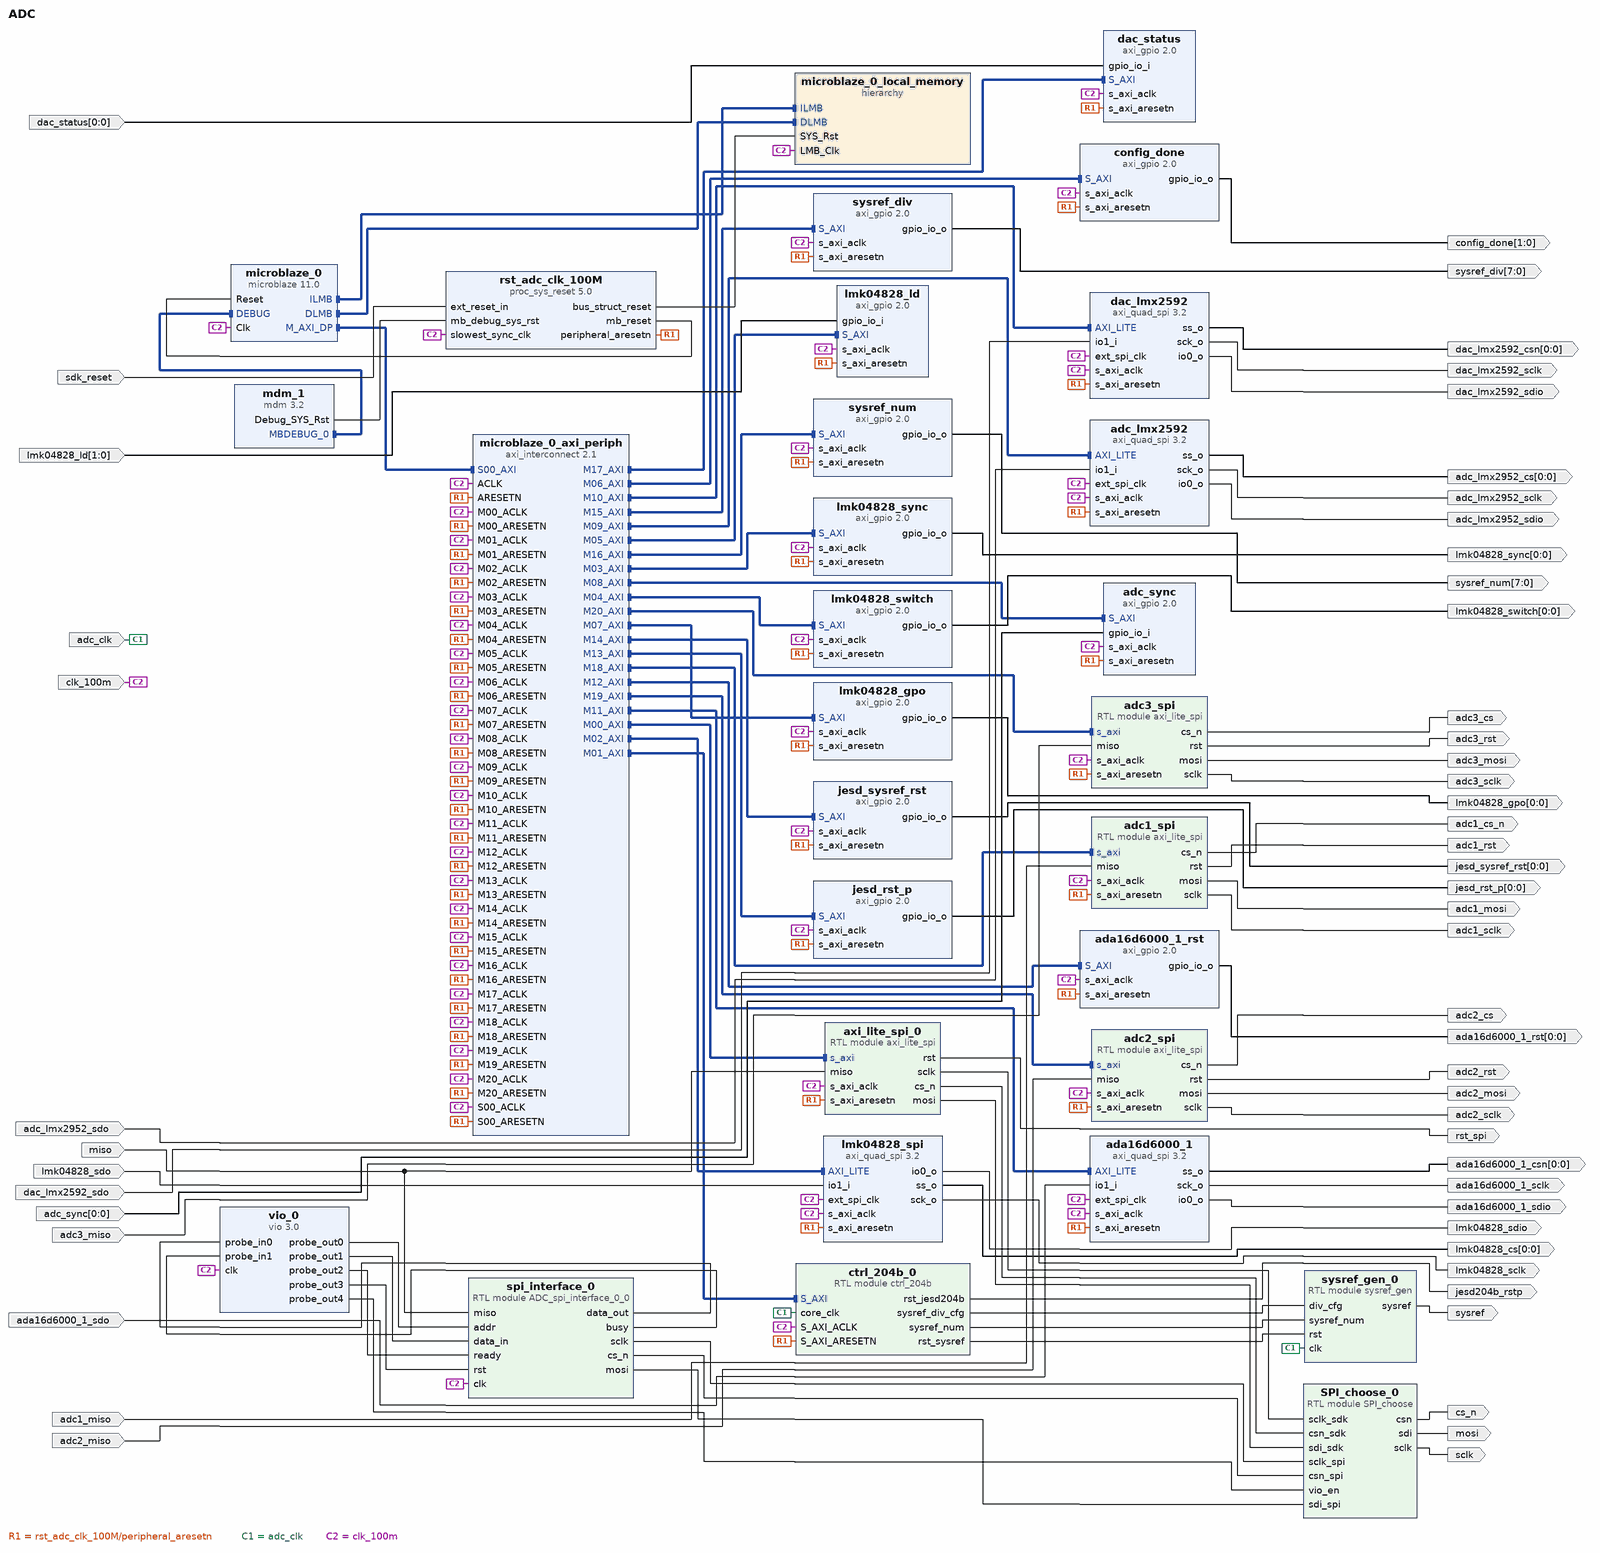
[diagram p0: block diagram of the top level]
# Vivado block design ADC, xc7vx690tffg1927-2, Vivado 2018.3
create_bd_design ADC

create_bd_port -dir O sysref
create_bd_port -dir O jesd204b_rstp
create_bd_port -dir I miso
create_bd_port -dir O mosi
create_bd_port -dir O sclk
create_bd_port -dir O cs_n
create_bd_port -dir O -type rst rst_spi
create_bd_port -dir O lmk04828_sdio
create_bd_port -dir I lmk04828_sdo
create_bd_port -dir O lmk04828_sclk
create_bd_port -dir O -from 0 -to 0 lmk04828_cs
create_bd_port -dir O -from 0 -to 0 lmk04828_sync
create_bd_port -dir O -from 0 -to 0 lmk04828_switch
create_bd_port -dir O -from 1 -to 0 config_done
create_bd_port -dir O -from 0 -to 0 lmk04828_gpo
create_bd_port -dir O adc_lmx2952_sdio
create_bd_port -dir I adc_lmx2952_sdo
create_bd_port -dir O adc_lmx2952_sclk
create_bd_port -dir O -from 0 -to 0 adc_lmx2952_cs
create_bd_port -dir I -type rst sdk_reset
set_property -dict {CONFIG.POLARITY ACTIVE_HIGH} [get_bd_ports sdk_reset]
create_bd_port -dir I -type clk clk_100m
create_bd_port -dir I -type clk adc_clk
create_bd_port -dir I -from 1 -to 0 lmk04828_ld
create_bd_port -dir I -from 0 -to 0 adc_sync
create_bd_port -dir O dac_lmx2592_sdio
create_bd_port -dir I dac_lmx2592_sdo
create_bd_port -dir O dac_lmx2592_sclk
create_bd_port -dir O -from 0 -to 0 dac_lmx2592_csn
create_bd_port -dir O ada16d6000_1_sdio
create_bd_port -dir I ada16d6000_1_sdo
create_bd_port -dir O ada16d6000_1_sclk
create_bd_port -dir O -from 0 -to 0 ada16d6000_1_csn
create_bd_port -dir O -from 0 -to 0 ada16d6000_1_rst
create_bd_port -dir O -from 0 -to 0 jesd_rst_p
create_bd_port -dir O -from 0 -to 0 jesd_sysref_rst
create_bd_port -dir O -from 7 -to 0 sysref_div
create_bd_port -dir O -from 7 -to 0 sysref_num
create_bd_port -dir I -from 0 -to 0 dac_status
create_bd_port -dir O -type rst adc1_rst
create_bd_port -dir O adc1_sclk
create_bd_port -dir O adc1_cs_n
create_bd_port -dir O adc1_mosi
create_bd_port -dir I adc1_miso
create_bd_port -dir O -type rst adc2_rst
create_bd_port -dir O adc2_sclk
create_bd_port -dir O adc2_cs
create_bd_port -dir O adc2_mosi
create_bd_port -dir I adc2_miso
create_bd_port -dir O -type rst adc3_rst
create_bd_port -dir O adc3_sclk
create_bd_port -dir O adc3_cs
create_bd_port -dir O adc3_mosi
create_bd_port -dir I adc3_miso

create_bd_cell -type module -reference axi_lite_spi axi_lite_spi_0
create_bd_cell -type module -reference SPI_choose SPI_choose_0
create_bd_cell -type module -reference ADC_spi_interface_0_0 spi_interface_0
create_bd_cell -type ip -vlnv xilinx.com:ip:vio:3.0 vio_0
set_property -dict [list \
  CONFIG.C_NUM_PROBE_IN 2 \
  CONFIG.C_NUM_PROBE_OUT 5 \
  CONFIG.C_PROBE_OUT0_WIDTH 16 \
  CONFIG.C_PROBE_OUT1_WIDTH 16 \
] [get_bd_cells vio_0]
create_bd_cell -type ip -vlnv xilinx.com:ip:axi_quad_spi:3.2 lmk04828_spi
set_property -dict {CONFIG.C_USE_STARTUP 0} [get_bd_cells lmk04828_spi]
create_bd_cell -type ip -vlnv xilinx.com:ip:axi_gpio:2.0 lmk04828_sync
set_property -dict {CONFIG.C_GPIO_WIDTH 1} [get_bd_cells lmk04828_sync]
create_bd_cell -type ip -vlnv xilinx.com:ip:axi_gpio:2.0 lmk04828_switch
set_property -dict {CONFIG.C_GPIO_WIDTH 1} [get_bd_cells lmk04828_switch]
create_bd_cell -type ip -vlnv xilinx.com:ip:axi_gpio:2.0 lmk04828_ld
set_property -dict {CONFIG.C_GPIO_WIDTH 2} [get_bd_cells lmk04828_ld]
create_bd_cell -type ip -vlnv xilinx.com:ip:axi_gpio:2.0 config_done
set_property -dict {CONFIG.C_GPIO_WIDTH 2} [get_bd_cells config_done]
create_bd_cell -type ip -vlnv xilinx.com:ip:axi_gpio:2.0 lmk04828_gpo
set_property -dict {CONFIG.C_GPIO_WIDTH 1} [get_bd_cells lmk04828_gpo]
create_bd_cell -type ip -vlnv xilinx.com:ip:axi_gpio:2.0 adc_sync
set_property -dict {CONFIG.C_GPIO_WIDTH 1} [get_bd_cells adc_sync]
create_bd_cell -type ip -vlnv xilinx.com:ip:axi_quad_spi:3.2 adc_lmx2592
set_property -dict {CONFIG.C_USE_STARTUP 0} [get_bd_cells adc_lmx2592]
create_bd_cell -type ip -vlnv xilinx.com:ip:microblaze:11.0 microblaze_0
set_property -dict {CONFIG.C_DEBUG_ENABLED 1 CONFIG.C_D_AXI 1 CONFIG.C_D_LMB 1 CONFIG.C_I_LMB 1} [get_bd_cells microblaze_0]
create_bd_cell -type ip -vlnv xilinx.com:ip:mdm:3.2 mdm_1
create_bd_cell -type ip -vlnv xilinx.com:ip:proc_sys_reset:5.0 rst_adc_clk_100M
create_bd_cell -type ip -vlnv xilinx.com:ip:axi_interconnect:2.1 microblaze_0_axi_periph
set_property -dict {CONFIG.NUM_MI 21} [get_bd_cells microblaze_0_axi_periph]
create_bd_cell -type hier microblaze_0_local_memory
create_bd_cell -type module -reference ctrl_204b ctrl_204b_0
create_bd_cell -type ip -vlnv xilinx.com:ip:axi_quad_spi:3.2 dac_lmx2592
set_property -dict {CONFIG.C_USE_STARTUP 0} [get_bd_cells dac_lmx2592]
create_bd_cell -type ip -vlnv xilinx.com:ip:axi_quad_spi:3.2 ada16d6000_1
set_property -dict {CONFIG.C_USE_STARTUP 0} [get_bd_cells ada16d6000_1]
create_bd_cell -type ip -vlnv xilinx.com:ip:axi_gpio:2.0 ada16d6000_1_rst
set_property -dict {CONFIG.C_GPIO_WIDTH 1} [get_bd_cells ada16d6000_1_rst]
create_bd_cell -type ip -vlnv xilinx.com:ip:axi_gpio:2.0 jesd_rst_p
set_property -dict {CONFIG.C_GPIO_WIDTH 1} [get_bd_cells jesd_rst_p]
create_bd_cell -type ip -vlnv xilinx.com:ip:axi_gpio:2.0 jesd_sysref_rst
set_property -dict {CONFIG.C_GPIO_WIDTH 1} [get_bd_cells jesd_sysref_rst]
create_bd_cell -type ip -vlnv xilinx.com:ip:axi_gpio:2.0 sysref_div
set_property -dict {CONFIG.C_GPIO_WIDTH 8} [get_bd_cells sysref_div]
create_bd_cell -type ip -vlnv xilinx.com:ip:axi_gpio:2.0 sysref_num
set_property -dict {CONFIG.C_GPIO_WIDTH 8} [get_bd_cells sysref_num]
create_bd_cell -type ip -vlnv xilinx.com:ip:axi_gpio:2.0 dac_status
set_property -dict {CONFIG.C_ALL_INPUTS 1 CONFIG.C_GPIO_WIDTH 1} [get_bd_cells dac_status]
create_bd_cell -type module -reference sysref_gen sysref_gen_0
create_bd_cell -type module -reference axi_lite_spi adc1_spi
create_bd_cell -type module -reference axi_lite_spi adc2_spi
create_bd_cell -type module -reference axi_lite_spi adc3_spi

# ---- hierarchy /microblaze_0_local_memory ----
current_bd_instance /microblaze_0_local_memory
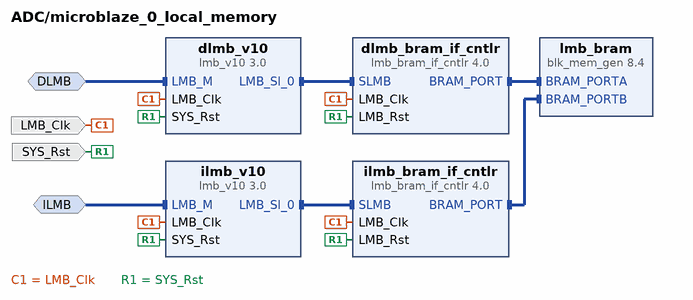
[diagram p1: block diagram inside /microblaze_0_local_memory]
create_bd_intf_pin -mode MirroredMaster -vlnv xilinx.com:interface:lmb_rtl:1.0 DLMB
create_bd_intf_pin -mode MirroredMaster -vlnv xilinx.com:interface:lmb_rtl:1.0 ILMB
create_bd_pin -dir I -type clk LMB_Clk
create_bd_pin -dir I -type rst SYS_Rst

create_bd_cell -type ip -vlnv xilinx.com:ip:lmb_v10:3.0 dlmb_v10
create_bd_cell -type ip -vlnv xilinx.com:ip:lmb_v10:3.0 ilmb_v10
create_bd_cell -type ip -vlnv xilinx.com:ip:lmb_bram_if_cntlr:4.0 dlmb_bram_if_cntlr
set_property -dict {CONFIG.C_ECC 0} [get_bd_cells dlmb_bram_if_cntlr]
create_bd_cell -type ip -vlnv xilinx.com:ip:lmb_bram_if_cntlr:4.0 ilmb_bram_if_cntlr
set_property -dict {CONFIG.C_ECC 0} [get_bd_cells ilmb_bram_if_cntlr]
create_bd_cell -type ip -vlnv xilinx.com:ip:blk_mem_gen:8.4 lmb_bram
set_property -dict {CONFIG.Memory_Type True_Dual_Port_RAM CONFIG.use_bram_block BRAM_Controller} [get_bd_cells lmb_bram]

# ---- connections ----

current_bd_instance /microblaze_0_local_memory
connect_bd_intf_net -intf_net microblaze_0_dlmb_cntlr [get_bd_intf_pins dlmb_bram_if_cntlr/BRAM_PORT] [get_bd_intf_pins lmb_bram/BRAM_PORTA]
connect_bd_intf_net -intf_net microblaze_0_ilmb_cntlr [get_bd_intf_pins ilmb_bram_if_cntlr/BRAM_PORT] [get_bd_intf_pins lmb_bram/BRAM_PORTB]
connect_bd_intf_net -intf_net microblaze_0_dlmb_bus [get_bd_intf_pins dlmb_v10/LMB_Sl_0] [get_bd_intf_pins dlmb_bram_if_cntlr/SLMB]
connect_bd_intf_net -intf_net microblaze_0_ilmb_bus [get_bd_intf_pins ilmb_v10/LMB_Sl_0] [get_bd_intf_pins ilmb_bram_if_cntlr/SLMB]
connect_bd_intf_net -intf_net microblaze_0_dlmb [get_bd_intf_pins DLMB] [get_bd_intf_pins dlmb_v10/LMB_M]
connect_bd_intf_net -intf_net microblaze_0_ilmb [get_bd_intf_pins ILMB] [get_bd_intf_pins ilmb_v10/LMB_M]
connect_bd_net -net microblaze_0_Clk [get_bd_pins LMB_Clk] \
  [get_bd_pins dlmb_v10/LMB_Clk] [get_bd_pins dlmb_bram_if_cntlr/LMB_Clk] [get_bd_pins ilmb_v10/LMB_Clk] \
  [get_bd_pins ilmb_bram_if_cntlr/LMB_Clk]
connect_bd_net [get_bd_pins SYS_Rst] \
  [get_bd_pins dlmb_v10/SYS_Rst] [get_bd_pins dlmb_bram_if_cntlr/LMB_Rst] [get_bd_pins ilmb_v10/SYS_Rst] \
  [get_bd_pins ilmb_bram_if_cntlr/LMB_Rst]
set_property HDL_ATTRIBUTE.BMM_INFO_ADDRESS_SPACE {byte  0x00000000 32 > ADC microblaze_0_local_memory/lmb_bram} [get_bd_cells dlmb_bram_if_cntlr]
set_property HDL_ATTRIBUTE.KEEP_HIERARCHY yes [get_bd_cells dlmb_bram_if_cntlr]

current_bd_instance /
connect_bd_intf_net [get_bd_intf_pins microblaze_0_axi_periph/M11_AXI] [get_bd_intf_pins ada16d6000_1/AXI_LITE]
connect_bd_intf_net [get_bd_intf_pins microblaze_0_axi_periph/M10_AXI] [get_bd_intf_pins dac_lmx2592/AXI_LITE]
connect_bd_intf_net [get_bd_intf_pins microblaze_0_axi_periph/M02_AXI] [get_bd_intf_pins lmk04828_spi/AXI_LITE]
connect_bd_intf_net [get_bd_intf_pins microblaze_0_axi_periph/M18_AXI] [get_bd_intf_pins adc1_spi/s_axi]
connect_bd_intf_net [get_bd_intf_pins microblaze_0_axi_periph/M06_AXI] [get_bd_intf_pins config_done/S_AXI]
connect_bd_intf_net [get_bd_intf_pins mdm_1/MBDEBUG_0] [get_bd_intf_pins microblaze_0/DEBUG]
connect_bd_intf_net [get_bd_intf_pins microblaze_0_axi_periph/M12_AXI] [get_bd_intf_pins ada16d6000_1_rst/S_AXI]
connect_bd_intf_net [get_bd_intf_pins microblaze_0_axi_periph/M15_AXI] [get_bd_intf_pins sysref_div/S_AXI]
connect_bd_intf_net [get_bd_intf_pins microblaze_0_axi_periph/M17_AXI] [get_bd_intf_pins dac_status/S_AXI]
connect_bd_intf_net [get_bd_intf_pins microblaze_0_axi_periph/M04_AXI] [get_bd_intf_pins lmk04828_switch/S_AXI]
connect_bd_intf_net [get_bd_intf_pins microblaze_0_axi_periph/M01_AXI] [get_bd_intf_pins ctrl_204b_0/S_AXI]
connect_bd_intf_net [get_bd_intf_pins microblaze_0_axi_periph/M08_AXI] [get_bd_intf_pins adc_sync/S_AXI]
connect_bd_intf_net [get_bd_intf_pins microblaze_0/ILMB] [get_bd_intf_pins microblaze_0_local_memory/ILMB]
connect_bd_intf_net [get_bd_intf_pins microblaze_0_axi_periph/M05_AXI] [get_bd_intf_pins lmk04828_ld/S_AXI]
connect_bd_intf_net [get_bd_intf_pins microblaze_0_axi_periph/M13_AXI] [get_bd_intf_pins jesd_rst_p/S_AXI]
connect_bd_intf_net [get_bd_intf_pins microblaze_0_axi_periph/M16_AXI] [get_bd_intf_pins sysref_num/S_AXI]
connect_bd_intf_net [get_bd_intf_pins microblaze_0_axi_periph/M20_AXI] [get_bd_intf_pins adc3_spi/s_axi]
connect_bd_intf_net [get_bd_intf_pins microblaze_0_axi_periph/M19_AXI] [get_bd_intf_pins adc2_spi/s_axi]
connect_bd_intf_net [get_bd_intf_pins microblaze_0_axi_periph/M03_AXI] [get_bd_intf_pins lmk04828_sync/S_AXI]
connect_bd_intf_net [get_bd_intf_pins microblaze_0_axi_periph/M14_AXI] [get_bd_intf_pins jesd_sysref_rst/S_AXI]
connect_bd_intf_net [get_bd_intf_pins microblaze_0/DLMB] [get_bd_intf_pins microblaze_0_local_memory/DLMB]
connect_bd_intf_net [get_bd_intf_pins microblaze_0_axi_periph/M00_AXI] [get_bd_intf_pins axi_lite_spi_0/s_axi]
connect_bd_intf_net [get_bd_intf_pins microblaze_0_axi_periph/M07_AXI] [get_bd_intf_pins lmk04828_gpo/S_AXI]
connect_bd_intf_net [get_bd_intf_pins microblaze_0_axi_periph/M09_AXI] [get_bd_intf_pins adc_lmx2592/AXI_LITE]
connect_bd_intf_net [get_bd_intf_pins microblaze_0/M_AXI_DP] [get_bd_intf_pins microblaze_0_axi_periph/S00_AXI]
connect_bd_net [get_bd_pins sysref_gen_0/sysref] [get_bd_ports sysref]
connect_bd_net [get_bd_pins ctrl_204b_0/sysref_div_cfg] [get_bd_pins sysref_gen_0/div_cfg]
connect_bd_net [get_bd_pins ctrl_204b_0/sysref_num] [get_bd_pins sysref_gen_0/sysref_num]
connect_bd_net [get_bd_pins ctrl_204b_0/rst_sysref] [get_bd_pins sysref_gen_0/rst]
connect_bd_net [get_bd_pins ctrl_204b_0/rst_jesd204b] [get_bd_ports jesd204b_rstp]
connect_bd_net [get_bd_pins vio_0/probe_out0] [get_bd_pins spi_interface_0/addr]
connect_bd_net [get_bd_pins vio_0/probe_out1] [get_bd_pins spi_interface_0/data_in]
connect_bd_net [get_bd_pins vio_0/probe_out2] [get_bd_pins spi_interface_0/ready]
connect_bd_net [get_bd_pins vio_0/probe_out3] [get_bd_pins spi_interface_0/rst]
connect_bd_net [get_bd_pins vio_0/probe_out4] [get_bd_pins SPI_choose_0/vio_en]
connect_bd_net -net miso_0_1 [get_bd_ports miso] [get_bd_pins spi_interface_0/miso] [get_bd_pins axi_lite_spi_0/miso]
connect_bd_net [get_bd_pins spi_interface_0/data_out] [get_bd_pins vio_0/probe_in0]
connect_bd_net [get_bd_pins spi_interface_0/busy] [get_bd_pins vio_0/probe_in1]
connect_bd_net [get_bd_pins spi_interface_0/sclk] [get_bd_pins SPI_choose_0/sclk_spi]
connect_bd_net [get_bd_pins spi_interface_0/cs_n] [get_bd_pins SPI_choose_0/csn_spi]
connect_bd_net [get_bd_pins spi_interface_0/mosi] [get_bd_pins SPI_choose_0/sdi_spi]
connect_bd_net [get_bd_pins axi_lite_spi_0/sclk] [get_bd_pins SPI_choose_0/sclk_sdk]
connect_bd_net [get_bd_pins axi_lite_spi_0/cs_n] [get_bd_pins SPI_choose_0/csn_sdk]
connect_bd_net [get_bd_pins axi_lite_spi_0/mosi] [get_bd_pins SPI_choose_0/sdi_sdk]
connect_bd_net [get_bd_pins SPI_choose_0/sdi] [get_bd_ports mosi]
connect_bd_net [get_bd_pins SPI_choose_0/sclk] [get_bd_ports sclk]
connect_bd_net [get_bd_pins SPI_choose_0/csn] [get_bd_ports cs_n]
connect_bd_net [get_bd_pins axi_lite_spi_0/rst] [get_bd_ports rst_spi]
connect_bd_net [get_bd_pins lmk04828_spi/io0_o] [get_bd_ports lmk04828_sdio]
connect_bd_net -net io1_i_0_1 [get_bd_ports lmk04828_sdo] [get_bd_pins lmk04828_spi/io1_i]
connect_bd_net [get_bd_pins lmk04828_spi/sck_o] [get_bd_ports lmk04828_sclk]
connect_bd_net [get_bd_pins lmk04828_spi/ss_o] [get_bd_ports lmk04828_cs]
connect_bd_net -net axi_gpio_0_gpio_io_o [get_bd_pins lmk04828_sync/gpio_io_o] [get_bd_ports lmk04828_sync]
connect_bd_net [get_bd_pins lmk04828_switch/gpio_io_o] [get_bd_ports lmk04828_switch]
connect_bd_net [get_bd_pins config_done/gpio_io_o] [get_bd_ports config_done]
connect_bd_net [get_bd_pins lmk04828_gpo/gpio_io_o] [get_bd_ports lmk04828_gpo]
connect_bd_net [get_bd_pins adc_lmx2592/io0_o] [get_bd_ports adc_lmx2952_sdio]
connect_bd_net -net io1_i_1_1 [get_bd_ports adc_lmx2952_sdo] [get_bd_pins adc_lmx2592/io1_i]
connect_bd_net [get_bd_pins adc_lmx2592/sck_o] [get_bd_ports adc_lmx2952_sclk]
connect_bd_net [get_bd_pins adc_lmx2592/ss_o] [get_bd_ports adc_lmx2952_cs]
connect_bd_net [get_bd_pins rst_adc_clk_100M/mb_reset] [get_bd_pins microblaze_0/Reset]
connect_bd_net [get_bd_pins mdm_1/Debug_SYS_Rst] [get_bd_pins rst_adc_clk_100M/mb_debug_sys_rst]
connect_bd_net [get_bd_pins rst_adc_clk_100M/peripheral_aresetn] \
  [get_bd_pins microblaze_0_axi_periph/S00_ARESETN] [get_bd_pins axi_lite_spi_0/s_axi_aresetn] \
  [get_bd_pins microblaze_0_axi_periph/M00_ARESETN] [get_bd_pins microblaze_0_axi_periph/ARESETN] \
  [get_bd_pins microblaze_0_axi_periph/M01_ARESETN] [get_bd_pins lmk04828_spi/s_axi_aresetn] \
  [get_bd_pins microblaze_0_axi_periph/M02_ARESETN] [get_bd_pins lmk04828_sync/s_axi_aresetn] \
  [get_bd_pins microblaze_0_axi_periph/M03_ARESETN] [get_bd_pins lmk04828_switch/s_axi_aresetn] \
  [get_bd_pins microblaze_0_axi_periph/M04_ARESETN] [get_bd_pins lmk04828_ld/s_axi_aresetn] \
  [get_bd_pins microblaze_0_axi_periph/M05_ARESETN] [get_bd_pins config_done/s_axi_aresetn] \
  [get_bd_pins microblaze_0_axi_periph/M06_ARESETN] [get_bd_pins lmk04828_gpo/s_axi_aresetn] \
  [get_bd_pins microblaze_0_axi_periph/M07_ARESETN] [get_bd_pins adc_sync/s_axi_aresetn] \
  [get_bd_pins microblaze_0_axi_periph/M08_ARESETN] [get_bd_pins adc_lmx2592/s_axi_aresetn] \
  [get_bd_pins microblaze_0_axi_periph/M09_ARESETN] [get_bd_pins ctrl_204b_0/S_AXI_ARESETN] \
  [get_bd_pins dac_lmx2592/s_axi_aresetn] [get_bd_pins microblaze_0_axi_periph/M10_ARESETN] \
  [get_bd_pins ada16d6000_1/s_axi_aresetn] [get_bd_pins microblaze_0_axi_periph/M11_ARESETN] \
  [get_bd_pins ada16d6000_1_rst/s_axi_aresetn] [get_bd_pins microblaze_0_axi_periph/M12_ARESETN] \
  [get_bd_pins jesd_rst_p/s_axi_aresetn] [get_bd_pins microblaze_0_axi_periph/M13_ARESETN] \
  [get_bd_pins jesd_sysref_rst/s_axi_aresetn] [get_bd_pins microblaze_0_axi_periph/M14_ARESETN] \
  [get_bd_pins sysref_div/s_axi_aresetn] [get_bd_pins microblaze_0_axi_periph/M15_ARESETN] \
  [get_bd_pins sysref_num/s_axi_aresetn] [get_bd_pins microblaze_0_axi_periph/M16_ARESETN] \
  [get_bd_pins dac_status/s_axi_aresetn] [get_bd_pins microblaze_0_axi_periph/M17_ARESETN] \
  [get_bd_pins adc1_spi/s_axi_aresetn] [get_bd_pins microblaze_0_axi_periph/M18_ARESETN] [get_bd_pins adc2_spi/s_axi_aresetn] \
  [get_bd_pins microblaze_0_axi_periph/M19_ARESETN] [get_bd_pins adc3_spi/s_axi_aresetn] \
  [get_bd_pins microblaze_0_axi_periph/M20_ARESETN]
connect_bd_net -net reset_rtl_0_1 [get_bd_ports sdk_reset] [get_bd_pins rst_adc_clk_100M/ext_reset_in]
connect_bd_net [get_bd_ports adc_clk] [get_bd_pins ctrl_204b_0/core_clk] [get_bd_pins sysref_gen_0/clk]
connect_bd_net -net slowest_sync_clk_0_1 [get_bd_ports clk_100m] \
  [get_bd_pins rst_adc_clk_100M/slowest_sync_clk] [get_bd_pins microblaze_0/Clk] [get_bd_pins microblaze_0_axi_periph/ACLK] \
  [get_bd_pins microblaze_0_axi_periph/S00_ACLK] [get_bd_pins microblaze_0_axi_periph/M00_ACLK] \
  [get_bd_pins microblaze_0_axi_periph/M01_ACLK] [get_bd_pins microblaze_0_axi_periph/M02_ACLK] \
  [get_bd_pins microblaze_0_axi_periph/M03_ACLK] [get_bd_pins microblaze_0_axi_periph/M04_ACLK] \
  [get_bd_pins microblaze_0_axi_periph/M05_ACLK] [get_bd_pins microblaze_0_axi_periph/M06_ACLK] \
  [get_bd_pins microblaze_0_axi_periph/M07_ACLK] [get_bd_pins microblaze_0_axi_periph/M08_ACLK] \
  [get_bd_pins microblaze_0_axi_periph/M09_ACLK] [get_bd_pins spi_interface_0/clk] [get_bd_pins vio_0/clk] \
  [get_bd_pins axi_lite_spi_0/s_axi_aclk] [get_bd_pins adc_sync/s_axi_aclk] [get_bd_pins config_done/s_axi_aclk] \
  [get_bd_pins lmk04828_gpo/s_axi_aclk] [get_bd_pins lmk04828_ld/s_axi_aclk] [get_bd_pins lmk04828_switch/s_axi_aclk] \
  [get_bd_pins lmk04828_sync/s_axi_aclk] [get_bd_pins lmk04828_spi/ext_spi_clk] [get_bd_pins lmk04828_spi/s_axi_aclk] \
  [get_bd_pins adc_lmx2592/s_axi_aclk] [get_bd_pins adc_lmx2592/ext_spi_clk] [get_bd_pins microblaze_0_local_memory/LMB_Clk] \
  [get_bd_pins ctrl_204b_0/S_AXI_ACLK] [get_bd_pins dac_lmx2592/s_axi_aclk] [get_bd_pins microblaze_0_axi_periph/M10_ACLK] \
  [get_bd_pins ada16d6000_1/s_axi_aclk] [get_bd_pins microblaze_0_axi_periph/M11_ACLK] \
  [get_bd_pins ada16d6000_1_rst/s_axi_aclk] [get_bd_pins microblaze_0_axi_periph/M12_ACLK] \
  [get_bd_pins jesd_rst_p/s_axi_aclk] [get_bd_pins microblaze_0_axi_periph/M13_ACLK] [get_bd_pins jesd_sysref_rst/s_axi_aclk] \
  [get_bd_pins microblaze_0_axi_periph/M14_ACLK] [get_bd_pins sysref_div/s_axi_aclk] \
  [get_bd_pins microblaze_0_axi_periph/M15_ACLK] [get_bd_pins sysref_num/s_axi_aclk] \
  [get_bd_pins microblaze_0_axi_periph/M16_ACLK] [get_bd_pins ada16d6000_1/ext_spi_clk] [get_bd_pins dac_lmx2592/ext_spi_clk] \
  [get_bd_pins dac_status/s_axi_aclk] [get_bd_pins microblaze_0_axi_periph/M17_ACLK] [get_bd_pins adc1_spi/s_axi_aclk] \
  [get_bd_pins microblaze_0_axi_periph/M18_ACLK] [get_bd_pins adc2_spi/s_axi_aclk] \
  [get_bd_pins microblaze_0_axi_periph/M19_ACLK] [get_bd_pins adc3_spi/s_axi_aclk] \
  [get_bd_pins microblaze_0_axi_periph/M20_ACLK]
connect_bd_net [get_bd_pins rst_adc_clk_100M/bus_struct_reset] [get_bd_pins microblaze_0_local_memory/SYS_Rst]
connect_bd_net -net gpio_io_i_0_1 [get_bd_ports lmk04828_ld] [get_bd_pins lmk04828_ld/gpio_io_i]
connect_bd_net -net gpio_io_i_0_2 [get_bd_ports adc_sync] [get_bd_pins adc_sync/gpio_io_i]
connect_bd_net [get_bd_pins dac_lmx2592/io0_o] [get_bd_ports dac_lmx2592_sdio]
connect_bd_net -net io1_i_0_2 [get_bd_ports dac_lmx2592_sdo] [get_bd_pins dac_lmx2592/io1_i]
connect_bd_net [get_bd_pins dac_lmx2592/sck_o] [get_bd_ports dac_lmx2592_sclk]
connect_bd_net [get_bd_pins dac_lmx2592/ss_o] [get_bd_ports dac_lmx2592_csn]
connect_bd_net [get_bd_pins ada16d6000_1/io0_o] [get_bd_ports ada16d6000_1_sdio]
connect_bd_net -net io1_i_0_3 [get_bd_ports ada16d6000_1_sdo] [get_bd_pins ada16d6000_1/io1_i]
connect_bd_net [get_bd_pins ada16d6000_1/sck_o] [get_bd_ports ada16d6000_1_sclk]
connect_bd_net [get_bd_pins ada16d6000_1/ss_o] [get_bd_ports ada16d6000_1_csn]
connect_bd_net [get_bd_pins ada16d6000_1_rst/gpio_io_o] [get_bd_ports ada16d6000_1_rst]
connect_bd_net -net ada16d6000_1_rst1_gpio_io_o [get_bd_pins jesd_rst_p/gpio_io_o] [get_bd_ports jesd_rst_p]
connect_bd_net [get_bd_pins jesd_sysref_rst/gpio_io_o] [get_bd_ports jesd_sysref_rst]
connect_bd_net [get_bd_pins sysref_div/gpio_io_o] [get_bd_ports sysref_div]
connect_bd_net [get_bd_pins sysref_num/gpio_io_o] [get_bd_ports sysref_num]
connect_bd_net [get_bd_ports dac_status] [get_bd_pins dac_status/gpio_io_i]
connect_bd_net -net axi_lite_spi_1_rst [get_bd_pins adc1_spi/rst] [get_bd_ports adc1_rst]
connect_bd_net -net axi_lite_spi_1_sclk [get_bd_pins adc1_spi/sclk] [get_bd_ports adc1_sclk]
connect_bd_net -net axi_lite_spi_1_cs_n [get_bd_pins adc1_spi/cs_n] [get_bd_ports adc1_cs_n]
connect_bd_net -net axi_lite_spi_1_mosi [get_bd_pins adc1_spi/mosi] [get_bd_ports adc1_mosi]
connect_bd_net [get_bd_ports adc1_miso] [get_bd_pins adc1_spi/miso]
connect_bd_net -net adc1_spi1_rst [get_bd_pins adc2_spi/rst] [get_bd_ports adc2_rst]
connect_bd_net -net adc1_spi1_sclk [get_bd_pins adc2_spi/sclk] [get_bd_ports adc2_sclk]
connect_bd_net -net adc1_spi1_cs_n [get_bd_pins adc2_spi/cs_n] [get_bd_ports adc2_cs]
connect_bd_net -net adc1_spi1_mosi [get_bd_pins adc2_spi/mosi] [get_bd_ports adc2_mosi]
connect_bd_net [get_bd_ports adc2_miso] [get_bd_pins adc2_spi/miso]
connect_bd_net -net adc1_spi1_rst1 [get_bd_pins adc3_spi/rst] [get_bd_ports adc3_rst]
connect_bd_net -net adc1_spi1_sclk1 [get_bd_pins adc3_spi/sclk] [get_bd_ports adc3_sclk]
connect_bd_net -net adc1_spi1_cs_n1 [get_bd_pins adc3_spi/cs_n] [get_bd_ports adc3_cs]
connect_bd_net -net adc1_spi1_mosi1 [get_bd_pins adc3_spi/mosi] [get_bd_ports adc3_mosi]
connect_bd_net [get_bd_ports adc3_miso] [get_bd_pins adc3_spi/miso]
set_property HDL_ATTRIBUTE.BMM_INFO_PROCESSOR {microblaze-le > ADC microblaze_0_local_memory/dlmb_bram_if_cntlr} [get_bd_cells microblaze_0]
set_property HDL_ATTRIBUTE.KEEP_HIERARCHY yes [get_bd_cells microblaze_0]

# ---- address map ----
assign_bd_address -offset 0x00000000 -range 512K -target_address_space [get_bd_addr_spaces microblaze_0/Data] [get_bd_addr_segs microblaze_0_local_memory/dlmb_bram_if_cntlr/SLMB/Mem]
assign_bd_address -offset 0x40000000 -range 64K -target_address_space [get_bd_addr_spaces microblaze_0/Data] [get_bd_addr_segs lmk04828_sync/S_AXI/Reg]
assign_bd_address -offset 0x40010000 -range 8K -target_address_space [get_bd_addr_spaces microblaze_0/Data] [get_bd_addr_segs lmk04828_switch/S_AXI/Reg]
assign_bd_address -offset 0x40020000 -range 64K -target_address_space [get_bd_addr_spaces microblaze_0/Data] [get_bd_addr_segs lmk04828_ld/S_AXI/Reg]
assign_bd_address -offset 0x40030000 -range 64K -target_address_space [get_bd_addr_spaces microblaze_0/Data] [get_bd_addr_segs config_done/S_AXI/Reg]
assign_bd_address -offset 0x40040000 -range 64K -target_address_space [get_bd_addr_spaces microblaze_0/Data] [get_bd_addr_segs lmk04828_gpo/S_AXI/Reg]
assign_bd_address -offset 0x40050000 -range 64K -target_address_space [get_bd_addr_spaces microblaze_0/Data] [get_bd_addr_segs adc_sync/S_AXI/Reg]
assign_bd_address -offset 0x40060000 -range 64K -target_address_space [get_bd_addr_spaces microblaze_0/Data] [get_bd_addr_segs ada16d6000_1_rst/S_AXI/Reg]
assign_bd_address -offset 0x40070000 -range 64K -target_address_space [get_bd_addr_spaces microblaze_0/Data] [get_bd_addr_segs jesd_rst_p/S_AXI/Reg]
assign_bd_address -offset 0x40080000 -range 64K -target_address_space [get_bd_addr_spaces microblaze_0/Data] [get_bd_addr_segs jesd_sysref_rst/S_AXI/Reg]
assign_bd_address -offset 0x40090000 -range 64K -target_address_space [get_bd_addr_spaces microblaze_0/Data] [get_bd_addr_segs sysref_div/S_AXI/Reg]
assign_bd_address -offset 0x400A0000 -range 64K -target_address_space [get_bd_addr_spaces microblaze_0/Data] [get_bd_addr_segs sysref_num/S_AXI/Reg]
assign_bd_address -offset 0x400B0000 -range 64K -target_address_space [get_bd_addr_spaces microblaze_0/Data] [get_bd_addr_segs dac_status/S_AXI/Reg]
assign_bd_address -offset 0x44A00000 -range 4K -target_address_space [get_bd_addr_spaces microblaze_0/Data] [get_bd_addr_segs axi_lite_spi_0/s_axi/reg0]
assign_bd_address -offset 0x44A10000 -range 4K -target_address_space [get_bd_addr_spaces microblaze_0/Data] [get_bd_addr_segs ctrl_204b_0/S_AXI/reg0]
assign_bd_address -offset 0x44A20000 -range 64K -target_address_space [get_bd_addr_spaces microblaze_0/Data] [get_bd_addr_segs lmk04828_spi/AXI_LITE/Reg]
assign_bd_address -offset 0x44A30000 -range 64K -target_address_space [get_bd_addr_spaces microblaze_0/Data] [get_bd_addr_segs adc_lmx2592/AXI_LITE/Reg]
assign_bd_address -offset 0x44A40000 -range 64K -target_address_space [get_bd_addr_spaces microblaze_0/Data] [get_bd_addr_segs dac_lmx2592/AXI_LITE/Reg]
assign_bd_address -offset 0x44A50000 -range 64K -target_address_space [get_bd_addr_spaces microblaze_0/Data] [get_bd_addr_segs ada16d6000_1/AXI_LITE/Reg]
assign_bd_address -offset 0x44A60000 -range 64K -target_address_space [get_bd_addr_spaces microblaze_0/Data] [get_bd_addr_segs adc1_spi/s_axi/reg0]
assign_bd_address -offset 0x44A70000 -range 64K -target_address_space [get_bd_addr_spaces microblaze_0/Data] [get_bd_addr_segs adc2_spi/s_axi/reg0]
assign_bd_address -offset 0x44A80000 -range 64K -target_address_space [get_bd_addr_spaces microblaze_0/Data] [get_bd_addr_segs adc3_spi/s_axi/reg0]
assign_bd_address -offset 0x00000000 -range 512K -target_address_space [get_bd_addr_spaces microblaze_0/Instruction] [get_bd_addr_segs microblaze_0_local_memory/ilmb_bram_if_cntlr/SLMB/Mem]

validate_bd_design
save_bd_design
